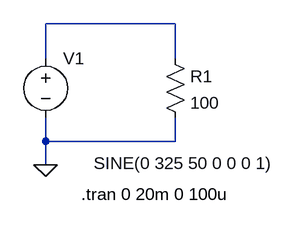
[diagram p0: schematic TestExample.asc]
TestExample.asc, the LTspice schematic file:
Version 4
SHEET 1 880 680
WIRE 272 80 96 80
WIRE 96 128 96 80
WIRE 272 128 272 80
WIRE 96 240 96 208
WIRE 272 240 272 208
WIRE 272 240 96 240
WIRE 96 272 96 240
FLAG 96 272 0
SYMBOL voltage 96 112 R0
WINDOW 3 313 158 Right 2
WINDOW 123 0 0 Left 0
WINDOW 39 0 0 Left 0
SYMATTR InstName V1
SYMATTR Value SINE(0 325 50 0 0 0 1)
SYMBOL res 256 112 R0
SYMATTR InstName R1
SYMATTR Value 100
TEXT 144 312 Left 2 !.tran 0 20m 0 100u

The netlist it stands for:
* TestExample.asc
V1 N001 0 SINE(0 325 50 0 0 0 1)
R1 N001 0 100
.tran 0 20m 0 100u
.backanno
.end